# EasyEDA schematic SCH_FPGA-board_2025-07-17.json

## Sheets
1 Sheet_1: TITLE: Sheet_1; REV: 1.0; Date: 2025-06-11; Sheet: 1/1; Company: Your Company
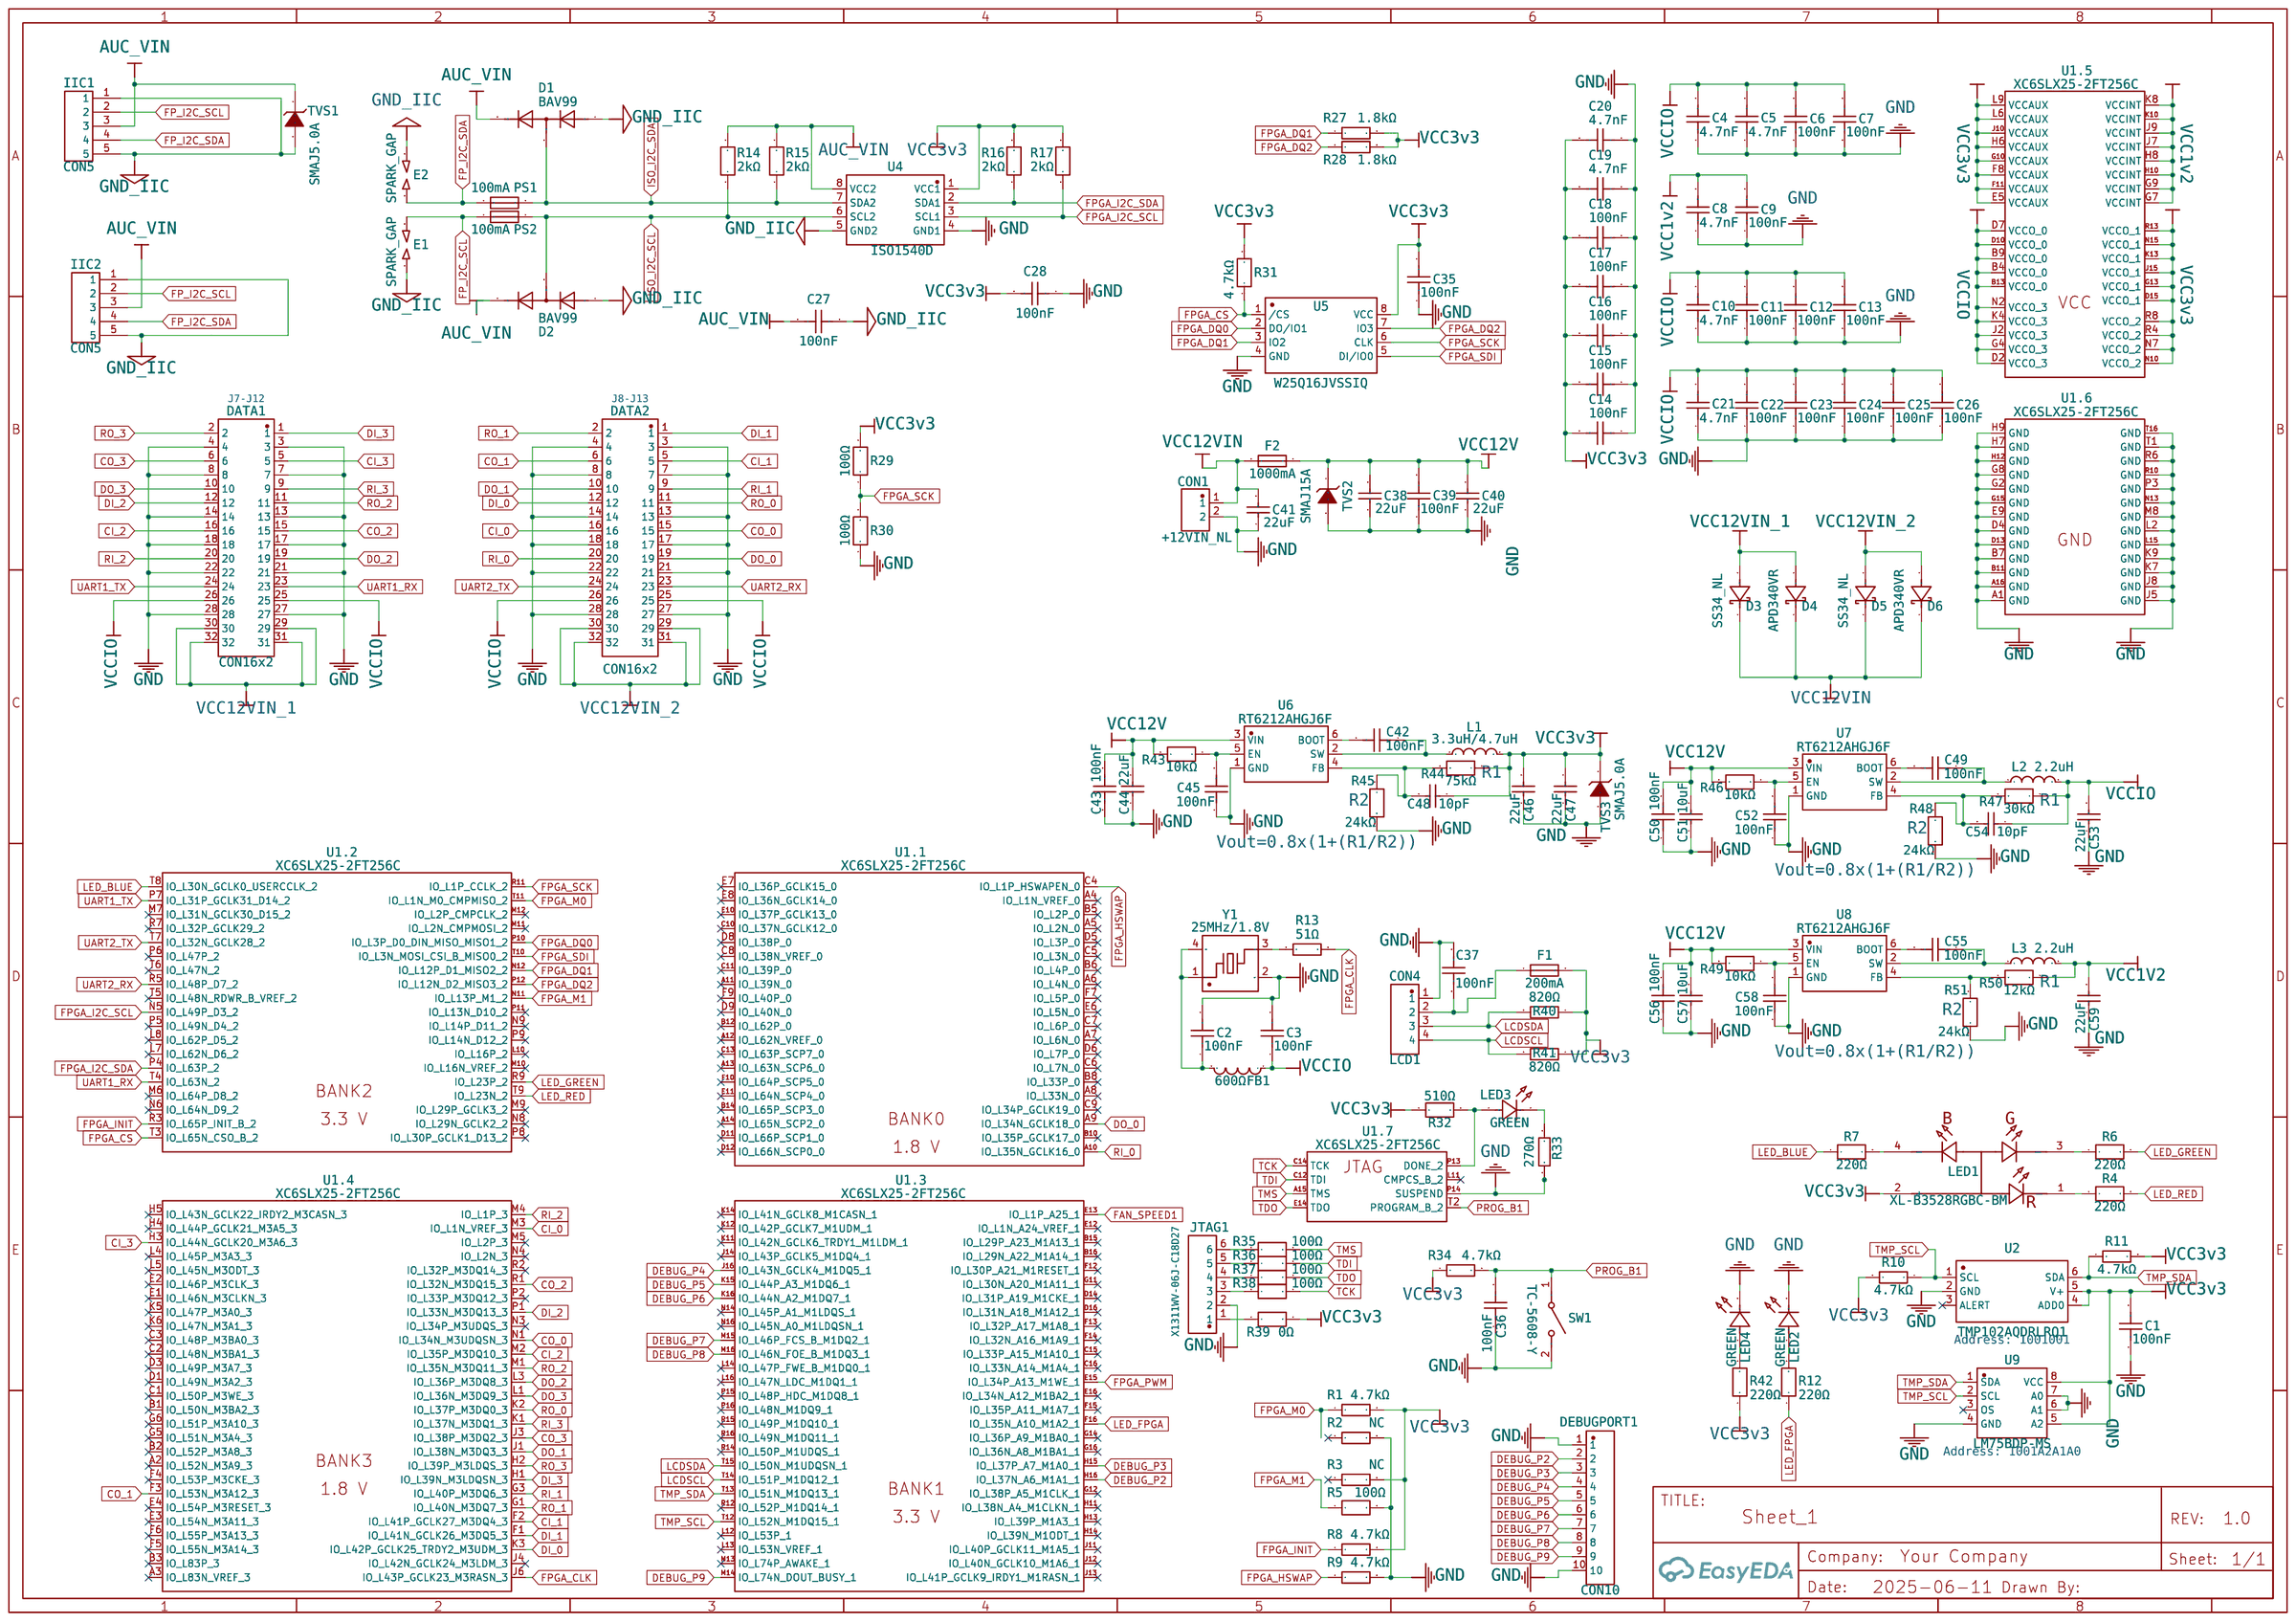
[diagram p0: Sheet_1]
2 Sheet_2: TITLE: Extend board; Date: 2025-07-18
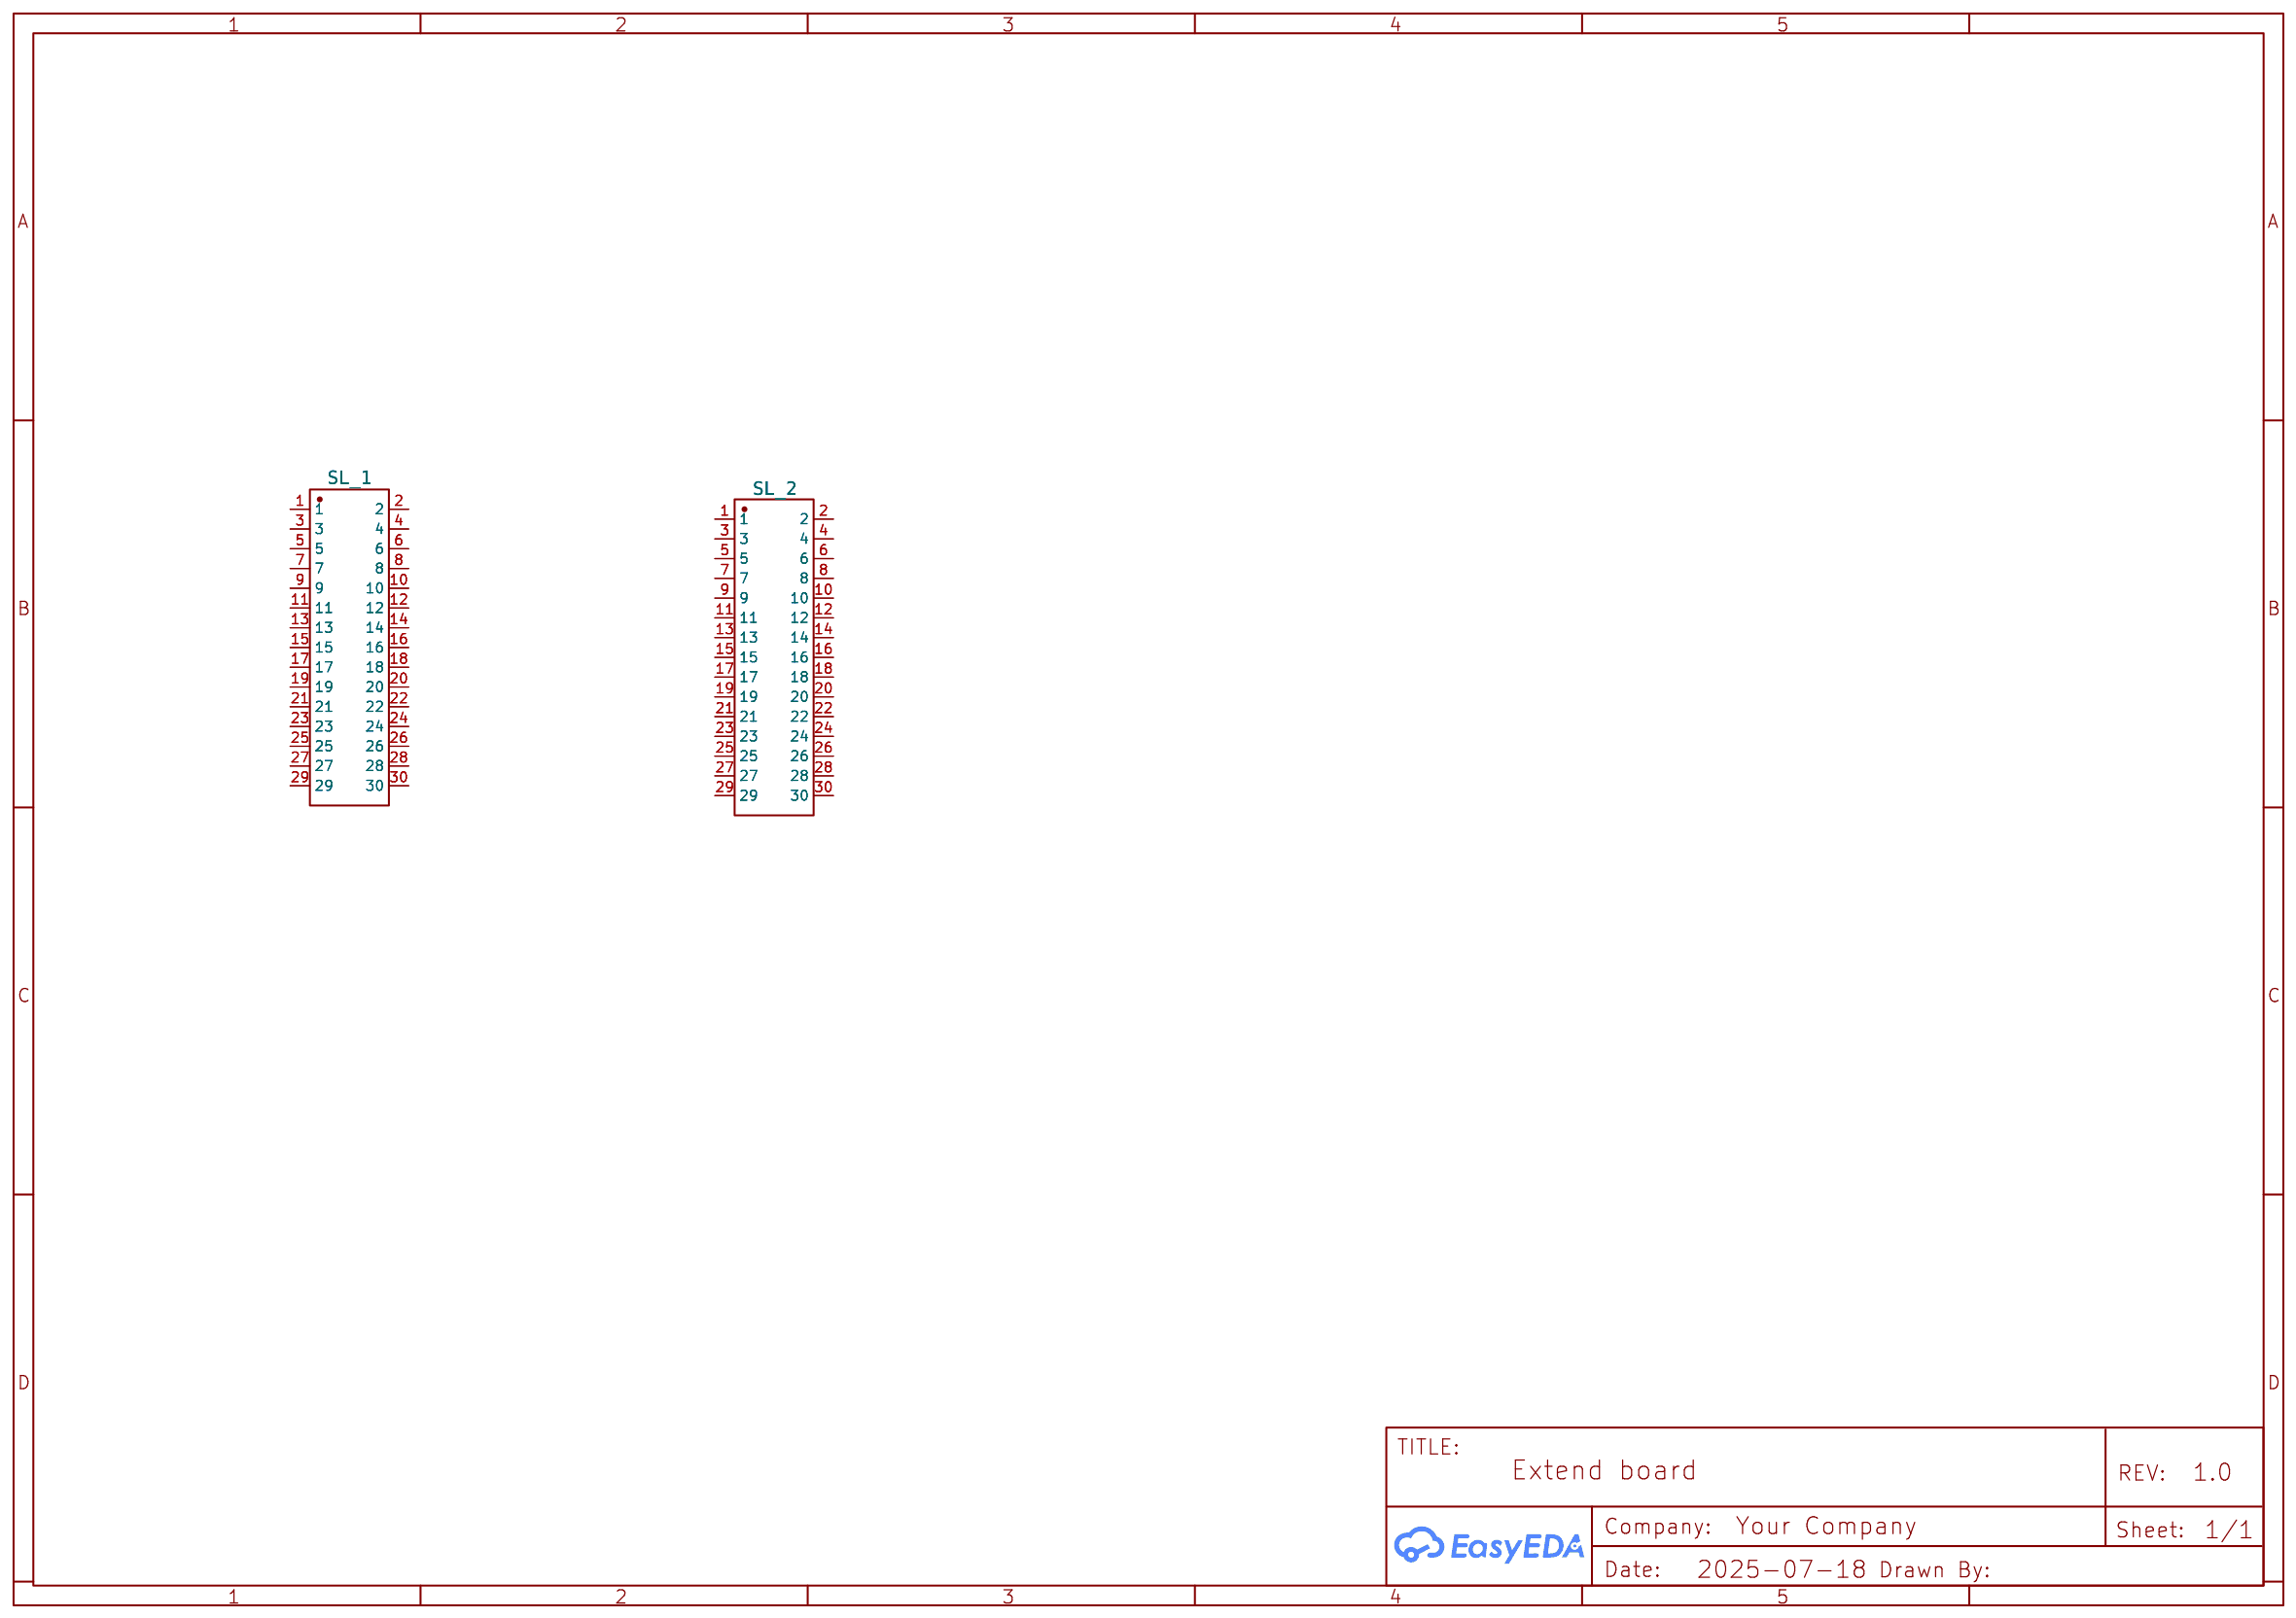
[diagram p1: Sheet_2]

## Parts
sheet Sheet_1
C1  100nF  [C0402]
C2  100nF  [C0402]
C3  100nF  [C0402]
C4  4.7nF  [C0402]
C5  4.7nF  [C0402]
C6  100nF  [C0402]
C7  100nF  [C0402]
C8  4.7nF  [C0402]
C9  100nF  [C0402]
C10  4.7nF  [C0402]
C11  100nF  [C0402]
C12  100nF  [C0402]
C13  100nF  [C0402]
C14  100nF  [C0402]
C15  100nF  [C0402]
C16  100nF  [C0402]
C17  100nF  [C0402]
C18  100nF  [C0402]
C19  4.7nF  [C0402]
C20  4.7nF  [C0402]
C21  4.7nF  [C0402]
C22  100nF  [C0402]
C23  100nF  [C0402]
C24  100nF  [C0402]
C25  100nF  [C0402]
C26  100nF  [C0402]
C27  100nF  [C0402]
C28  100nF  [C0402]
C35  100nF  [C0402]
C36  100nF  [C0402]
C37  100nF  [C0402]
C38  22uF  [C0805]
C39  100nF  [C0402]
C40  22uF  [C0805]
C41  22uF  [C0805]
C42  100nF  [C0402]
C43  100nF  [C0402]
C44  22uF  [C0805]
C45  100nF  [C0402]
C46  22uF  [C0805]
C47  22uF  [C0805]
C48  10pF  [C0805]
C49  100nF  [C0402]
C50  100nF  [C0402]
C51  10uF  [C0805]
C52  100nF  [C0402]
C53  22uF  [C0805]
C54  10pF  [C0805]
C55  100nF  [C0402]
C56  100nF  [C0402]
C57  10uF  [C0805]
C58  100nF  [C0402]
C59  22uF  [C0805]
CON1  +12VIN_NL  [CONN-TH_2.54-2P-WZDK-R-PITCH-CONNECTOR]
D1  BAV99  [SC-70-3_L2.1-W1.3-P1.30-LS2.1-BR]
D2  BAV99  [SC-70-3_L2.1-W1.3-P1.30-LS2.1-BR]
D3  SS34_NL  [SMA_L4.2-W2.7-LS5.0-RD]
D4  SS34_NL  [DO-214BA_L4.5-W2.6-LS5.4-RD]
D5  APD340VR  [SMA_L4.2-W2.7-LS5.0-RD]
D6  APD340VR  [DO-214BA_L4.5-W2.6-LS5.4-RD]
DATA1  CON16x2  [HDR-SMD_32P-P2.54-V-M-R2-C16-S7.4]
DATA2  CON16x2  [HDR-SMD_32P-P2.54-V-M-R2-C16-S7.4]
DEBUGPORT1  CON10  [HDR-TH_10P-P2.54-V-M]
E1  SPARK_GAP  [SPARK-GAP-8]
E2  SPARK_GAP  [SPARK-GAP-8]
F1  200mA  [F0805]
F2  1000mA  [F0805]
FB1  600Ω  [L0402]
IIC1  CON5  [XHB-TH_5PIN-V-PITCH2.50-R]
IIC2  CON5  [XHB-TH_5PIN-V-PITCH2.50-R]
JTAG1  X1311WV-06J-C18D27  [HDR-TH_6P-P1.27-V-M-1]
L1  3.3uH/4.7uH  [IND-SMD_L2.0-W1.6]
L2  2.2uH  [IND-SMD_L2.0-W1.6]
L3  2.2uH  [IND-SMD_L2.0-W1.6]
LCD1  CON4  [HDR-TH_4P-P1.27-V-M]
LED1  XL-B3528RGBC-BM  [LED-ARRAY-SMD_4P-L3.2-W2.8-BR_XL-B3528RGBC-BM]
LED2  GREEN  [LED0603-FD]
LED3  GREEN  [LED0603-FD]
LED4  GREEN  [LED0603-FD]
PS1  100mA  [F0603]
PS2  100mA  [F0603]
R1  4.7kΩ  [R0805]
R2  NC  [R0805]
R3  NC  [R0805]
R4  220Ω  [R0402]
R5  100Ω  [R0402]
R6  220Ω  [R0402]
R7  220Ω  [R0402]
R8  4.7kΩ  [R0805]
R9  4.7kΩ  [R0805]
R10  4.7kΩ  [R0805]
R11  4.7kΩ  [R0805]
R12  220Ω  [R0402]
R13  51Ω  [R0603]
R14  2kΩ  [R0402]
R15  2kΩ  [R0402]
R16  2kΩ  [R0402]
R17  2kΩ  [R0402]
R27  1.8kΩ  [R0402]
R28  1.8kΩ  [R0402]
R29  100Ω  [R0402]
R30  100Ω  [R0402]
R31  4.7kΩ  [R0402]
R32  510Ω  [R0603]
R33  270Ω  [R0603]
R34  4.7kΩ  [R0805]
R35  100Ω  [R0402]
R36  100Ω  [R0402]
R37  100Ω  [R0402]
R38  100Ω  [R0402]
R39  0Ω  [R0402]
R40  820Ω  [R0402]
R41  820Ω  [R0402]
R42  220Ω  [R0402]
R43  10kΩ  [R0402]
R44  75kΩ  [R0402]
R45  24kΩ  [R0402]
R46  10kΩ  [R0402]
R47  30kΩ  [R0402]
R48  24kΩ  [R0402]
R49  10kΩ  [R0402]
R50  12kΩ  [R0402]
R51  24kΩ  [R0402]
SW1  TC-5608-Y  [KEY-SMD_TC-5608-Y]
TVS1  SMAJ5.0A  [SMA_L4.3-W2.6-LS5.1-RD]
TVS2  SMAJ15A  [SMA_L4.3-W2.6-LS5.1-RD]
TVS3  SMAJ5.0A  [SMA_L4.3-W2.6-LS5.1-RD]
U1  XC6SLX25-2FT256C  [XC6SLX25-3FTG256]  (sections 1,2,3,4,5,6,7)
U2  TMP102AQDRLRQ1  [SOT-666-6_L1.6-W1.2-P0.50-LS1.6-BR]
U4  ISO1540D  [SOIC-8_L5.0-W4.0-P1.27-LS6.0-BL]
U5  W25Q16JVSSIQ  [SOIC-8_L5.3-W5.3-P1.27-LS8.0-BL]
U6  RT6212AHGJ6F  [SOT-23-6_L2.9-W1.6-P0.95-LS2.8-BL]
U7  RT6212AHGJ6F  [SOT-23-6_L2.9-W1.6-P0.95-LS2.8-BL]
U8  RT6212AHGJ6F  [SOT-23-6_L2.9-W1.6-P0.95-LS2.8-BL]
U9  LM75BDP-MS  [MSOP-8_L3.0-W3.0-P0.65-LS4.9-BL]
Y1  25MHz/1.8V  [CRYSTAL-SMD_4P-L3.2-W2.5-BL]
sheet Sheet_2
SL_1  HC-PM200-6.35H-2X15PZ  [HDR-TH_30P-P2.00-V-F-R2-C15-S2.00-1]
SL_2  HC-PM200-6.35H-2X15PZ  [HDR-TH_30P-P2.00-V-F-R2-C15-S2.00-1]

## Library data of the parts
C1-C3 C6 C7 C9 C11-C18 C22-C28 C35-C37 C39 C42 C43 C45 C49 C50 C52 C55 C56 C58 = FCC0402B104K160AT: Supplier: LCSC; Supplier Part: C5137468; Manufacturer: FOJAN(富捷); JLCPCB Part Class: Extended Part; Contributor: lcsc
C4 C5 C8 C10 C19-C21 = GRM155R71C472KA01D: Contributor: LCSC; Supplier: LCSC; Supplier Part: C441740; Manufacturer: muRata(村田); JLCPCB Part Class: Extended Part
C38 C40 C41 C44 C46-C48 C51 C53 C54 C57 C59 = CC0805MKX5R8BB226: Supplier: LCSC; Supplier Part: C784585; Manufacturer: YAGEO(国巨); JLCPCB Part Class: Extended Part; Contributor: lcsc
CON1 = 2.54-2P WZDK-R PITCH CONNECTOR: Supplier: LCSC; Supplier Part: C49023803; Manufacturer: SHOU HAN(首韩); Manufacturer Part: 2.54-2P WZDK-R Pitch Connector; JLCPCB Part Class: Extended Part; Contributor: lcsc
D1 D2 = BAV99WT1G: Contributor: LCSC; Supplier Part: C82078; Supplier: LCSC; Manufacturer: onsemi(安森美); JLCPCB Part Class: Extended Part
D3 D5 = SS34_C2909963: Contributor: LCSC; Supplier: LCSC; Supplier Part: C2909963; Manufacturer: YONGYUTAI(永裕泰); Manufacturer Part: SS34; JLCPCB Part Class: Extended Part
D4 D6 = SS34A_C2759883: Contributor: LCSC; Supplier: LCSC; Supplier Part: C2759883; Manufacturer: Leiditech(雷卯电子); Manufacturer Part: SS34A; JLCPCB Part Class: Extended Part
DATA1 DATA2 = KH-2.54PH-2X16P-L11.0-SMT: Supplier: LCSC; Supplier Part: C19630982; Manufacturer: kinghelm(金航标); Contributor: lcsc; JLCPCB Part Class: Extended Part
DEBUGPORT1 = DZ254R-11-10-63: Contributor: LCSC; Supplier: LCSC; Supplier Part: C2935916; Manufacturer: DEALON(德艺隆); JLCPCB Part Class: Extended Part
E1 E2 = SPARK_GAP: Contributor: surajk13; license: https://www.gnu.org/licenses/lgpl-2.1.html; Manufacturer Part: spark gap_0.3mm; link: https://eu.mouser.com/ProductDetail/Yageo/SQP500JB-330R?qs=sGAEpiMZZMukHu%252BjC5l7YQp%252BqQWMCRPe6cPdIgn3vDw%3D
F1 F2 = F0805B0R25FSTR: Supplier: LCSC; Supplier Part: C6245394; Manufacturer: Kyocera AVX; JLCPCB Part Class: Extended Part; Contributor: lcsc
FB1 = PBY100505T-601Y-N: Contributor: LCSC; Supplier: LCSC; Manufacturer: chilisin(奇力新); Supplier Part: C142082; JLCPCB Part Class: Extended Part
IIC1 IIC2 = XHB-5A: Supplier: LCSC; Manufacturer: BOOMELE(博穆精密); Supplier Part: C66559; JLCPCB Part Class: Extended Part
JTAG1 = X1311WV-06J-C18D27: Contributor: LCSC; Supplier: LCSC; Supplier Part: C2881651; Manufacturer: XKB Connection(中国星坤); JLCPCB Part Class: Extended Part
L1-L3 = SFE201610-4R7M: Contributor: lcsc; Supplier: LCSC; Supplier Part: C5159660; Manufacturer: DDY(德立); JLCPCB Part Class: Extended Part
LCD1 = DZ127R-11-04-25: Contributor: LCSC; Supplier: LCSC; Supplier Part: C2935944; Manufacturer: DEALON(德艺隆); JLCPCB Part Class: Extended Part
LED1 = XL-B3528RGBC-BM: Supplier: LCSC; Supplier Part: C5440719; Manufacturer: XINGLIGHT(成兴光); JLCPCB Part Class: Extended Part; Contributor: lcsc
LED2-LED4 = SM0603UPGC: Supplier: LCSC; Supplier Part: C6679544; Manufacturer: BIVAR; Contributor: lcsc; JLCPCB Part Class: Extended Part
PS1 PS2 = PTS060315V010: Supplier: LCSC; Supplier Part: C3762027; Manufacturer: EATON(伊顿); JLCPCB Part Class: Extended Part; Contributor: lcsc
R1-R3 R8-R11 R34 = CR0805F4K7P05: Contributor: LCSC; Supplier: LCSC; Supplier Part: C245341; Manufacturer: EVER OHMS(天二科技); Manufacturer Part: CR0805F4K70P05Z; JLCPCB Part Class: Extended Part
R4 R6 R7 R12 R42 = CRCW0402220RFKED: Contributor: LCSC; Supplier: LCSC; Supplier Part: C482103; Manufacturer: VISHAY(威世); JLCPCB Part Class: Extended Part
R5 = CRCW0402100RFKEDHP: Supplier: LCSC; Supplier Part: C844502; Manufacturer: VISHAY(威世); JLCPCB Part Class: Extended Part; Contributor: lcsc
R13 = CR0603FA51R0G: Supplier: LCSC; Manufacturer: LIZ(丽智电子); Supplier Part: C101090; JLCPCB Part Class: Extended Part
R14-R17 = ERA2AED202X: Contributor: LCSC; Supplier: LCSC; Supplier Part: C336808; Manufacturer: PANASONIC(松下); JLCPCB Part Class: Extended Part
R27 R28 = RC0402FR-071K8L: Contributor: LCSC; Supplier: LCSC; Manufacturer: YAGEO(国巨); Supplier Part: C163481; JLCPCB Part Class: Extended Part
R29 R30 R43-R51 = SR0402FR-7T100RL: Supplier: LCSC; Supplier Part: C854479; Manufacturer: YAGEO(国巨); JLCPCB Part Class: Extended Part; Contributor: lcsc
R31 = SY0402FN4K7P: Contributor: LCSC; Supplier: LCSC; Supplier Part: C380739; Manufacturer: SANYEAR(叁叶源); JLCPCB Part Class: Extended Part
R32 = AT0603BRD07510RL: Supplier: LCSC; Supplier Part: C5454463; Manufacturer: YAGEO(国巨); Contributor: lcsc
R33 = HPCR0603F270RK9: Contributor: LCSC; Supplier: LCSC; Supplier Part: C365130; Manufacturer: RESI(开步睿思); JLCPCB Part Class: Extended Part
R35-R38 = RC0402FR-07100RP: Supplier: LCSC; Supplier Part: C851815; Manufacturer: YAGEO(国巨); JLCPCB Part Class: Extended Part; Contributor: lcsc
R39 = SCR0402J0R: Contributor: lcsc; Supplier: LCSC; Supplier Part: C3017451; Manufacturer: VO(翔胜); JLCPCB Part Class: Extended Part
R40 R41 = AC0402FR-07820RL: Contributor: LCSC; Supplier: LCSC; Supplier Part: C227240; Manufacturer: YAGEO(国巨); JLCPCB Part Class: Extended Part
SW1 = TC-5608-Y: Contributor: lcsc; Supplier: LCSC; Supplier Part: C5148427; Manufacturer: Yuandi(元迪); JLCPCB Part Class: Extended Part
TVS1-TVS3 = SMAJ5.0A-AT: Contributor: LCSC; Supplier: LCSC; Supplier Part: C523242; Manufacturer: Brightking(君耀电子); Manufacturer Part: SMAJ5.0A-AT/TR13; JLCPCB Part Class: Extended Part
U1 = XC6SLX25-2FT256C: Manufacturer: AMD(超微); Supplier: LCSC; Supplier Part: C7416133; Contributor: 1234ujif; subpart_no: 1
U2 = TMP102AQDRLRQ1: Contributor: LCSC; Supplier: LCSC; Manufacturer: TI(德州仪器); Supplier Part: C130042; JLCPCB Part Class: Extended Part
U4 = ISO1540D: Contributor: LCSC; Supplier: LCSC; Supplier Part: C2878172; Manufacturer: TI(德州仪器); JLCPCB Part Class: Extended Part
U5 = W25Q16JVSSIQ: Supplier: LCSC; Manufacturer: WINBOND(华邦); Supplier Part: C82317; JLCPCB Part Class: Extended Part
U6-U8 = RT6212AHGJ6F: Contributor: LCSC; Supplier: LCSC; Supplier Part: C250402; Manufacturer: RICHTEK(立锜); JLCPCB Part Class: Extended Part; Package Display: No
U9 = LM75BDP-MS: Supplier: LCSC; Supplier Part: C18547812; Manufacturer: MSKSEMI(美森科); Contributor: lcsc; JLCPCB Part Class: Extended Part
Y1 = FL2500047: Supplier: LCSC; Supplier Part: C5701090; Manufacturer: DIODES(美台); JLCPCB Part Class: Extended Part; Contributor: lcsc
SL_1 SL_2 = HC-PM200-6.35H-2X15PZ: Supplier: LCSC; Supplier Part: C41376153; Manufacturer: HC(虹成电子); Manufacturer Part: HC-PM200-6.35H-2x15PZ; Contributor: lcsc

## Nets
GND: C1.1 C2.2 C3.2 C4.1 C5.1 C6.1 C7.1 C8.1 C9.1 C10.1 C11.1 C12.1 C13.1 C14.1 C15.1 C16.1 C17.1 C18.1 C19.1 C20.1 C21.1 C22.1 C23.1 C24.1 C25.1 C26.1 C28.1 C35.1 C36.1 C37.2 C38.1 C39.1 C40.1 C41.1 C43.1 C44.1 C45.1 C46.1 C47.1 C50.1 C51.1 C52.1 C53.1 C56.1 C57.1 C58.1 C59.1 CON1.2 DATA1.3 DATA1.4 DATA1.7 DATA1.8 DATA1.13 DATA1.14 DATA1.17 DATA1.18 DATA1.21 DATA1.22 DATA1.27 DATA1.28 DATA2.3 DATA2.4 DATA2.7 DATA2.8 DATA2.13 DATA2.14 DATA2.17 DATA2.18 DATA2.21 DATA2.22 DATA2.27 DATA2.28 DEBUGPORT1.1 DEBUGPORT1.10 JTAG1.2 LCD1.1 LED2.2(K) LED4.2(K) R2.2 R5.2 R9.2 R30.1 R33.1 R45.2 R48.2 R51.2 SW1.2 TVS2.2(A) TVS3.2(A) U1.A1(GND) U1.A16(GND) U1.B7(GND) U1.B11(GND) U1.D4(GND) U1.D13(GND) U1.E9(GND) U1.G2(GND) U1.G8(GND) U1.G15(GND) U1.H7(GND) U1.H9(GND) U1.H12(GND) U1.J5(GND) U1.J8(GND) U1.K7(GND) U1.K9(GND) U1.L2(GND) U1.L15(GND) U1.M8(GND) U1.N13(GND) U1.P3(GND) U1.P14(SUSPEND) U1.R6(GND) U1.R10(GND) U1.T1(GND) U1.T16(GND) U2.2(GND) U4.4(GND1) U5.4(GND) U6.1(GND) U7.1(GND) U8.1(GND) U9.4(GND) U9.6(A1) U9.7(A0) Y1.2(GND)
GND_IIC: C27.1 D1.1(A) D2.1(A) E1.1 E2.2 IIC1.1 IIC1.5 IIC2.1 IIC2.5 TVS1.2(A) U4.5(GND2)
VCC1v2: C8.2 C9.2 U1.G7(VCCINT) U1.G9(VCCINT) U1.H8(VCCINT) U1.H10(VCCINT) U1.J7(VCCINT) U1.J9(VCCINT) U1.K8(VCCINT) U1.K10(VCCINT)
VCC1V2: C59.2 L3.2 R50.1
VCC3v3: C1.2 C14.2 C15.2 C16.2 C17.2 C18.2 C19.2 C20.2 C28.2 C35.2 C46.2 C47.2 C48.1 F1.2 L1.2 LED1.2(+) R1.2 R3.2 R8.2 R10.2 R11.2 R16.2 R17.2 R27.2 R28.2 R29.2 R31.2 R32.1 R34.1 R39.2 R40.1 R41.1 R42.1 R44.1 TVS3.1(C) U1.D15(VCCO_1) U1.E5(VCCAUX) U1.F8(VCCAUX) U1.F11(VCCAUX) U1.G10(VCCAUX) U1.G13(VCCO_1) U1.H6(VCCAUX) U1.J10(VCCAUX) U1.J15(VCCO_1) U1.K13(VCCO_1) U1.L6(VCCAUX) U1.L9(VCCAUX) U1.N7(VCCO_2) U1.N10(VCCO_2) U1.N15(VCCO_1) U1.R4(VCCO_2) U1.R8(VCCO_2) U1.R13(VCCO_1) U2.4(ADD0) U2.5(V+) U4.1(VCC1) U5.8(VCC) U9.5(A2) U9.8(VCC)
VCC12V: C38.2 C39.2 C40.2 C43.2 C44.2 C50.2 C51.2 C56.2 C57.2 F2.2 R43.2 R46.2 R49.2 TVS2.1(C) U6.3(VIN) U7.3(VIN) U8.3(VIN)
VCC12VIN: C41.2 CON1.1 D3.1 D4.1(K) D5.1 D6.1(K) F2.1
VCC12VIN_1: D3.2 D4.2(A) DATA1.29 DATA1.30 DATA1.31 DATA1.32
VCC12VIN_2: D5.2 D6.2(A) DATA2.29 DATA2.30 DATA2.31 DATA2.32
VCCIO: C3.1 C4.2 C5.2 C6.2 C7.2 C10.2 C11.2 C12.2 C13.2 C21.2 C22.2 C23.2 C24.2 C25.2 C26.2 C53.2 C54.1 DATA1.25 DATA1.26 DATA2.25 DATA2.26 FB1.1 L2.2 R47.1 U1.B4(VCCO_0) U1.B9(VCCO_0) U1.B13(VCCO_0) U1.D2(VCCO_3) U1.D7(VCCO_0) U1.D10(VCCO_0) U1.G4(VCCO_3) U1.J2(VCCO_3) U1.K4(VCCO_3) U1.N2(VCCO_3)
AUC_VIN: C27.2 D1.2(C) D2.2(C) IIC1.3 IIC2.3 R14.2 R15.2 TVS1.1(C) U4.8(VCC2)
CI_0: DATA2.16 U1.M3(IO_L1N_VREF_3)
CI_1: DATA2.5 U1.F2(IO_L41P_GCLK27_M3DQ4_3)
CI_2: DATA1.16 U1.M2(IO_L35P_M3DQ10_3)
CI_3: DATA1.5 U1.H3(IO_L44N_GCLK20_M3A6_3)
CO_0: DATA2.15 U1.N1(IO_L34N_M3UDQSN_3)
CO_1: DATA2.6 U1.F3(IO_L53N_M3A12_3)
CO_2: DATA1.15 U1.R1(IO_L32N_M3DQ15_3)
CO_3: DATA1.6 U1.J3(IO_L38P_M3DQ2_3)
DEBUG_P2: DEBUGPORT1.2 U1.H16(IO_L37N_A6_M1A1_1)
DEBUG_P3: DEBUGPORT1.3 U1.H15(IO_L37P_A7_M1A0_1)
DEBUG_P4: DEBUGPORT1.4 U1.J16(IO_L43N_GCLK4_M1DQ5_1)
DEBUG_P5: DEBUGPORT1.5 U1.K15(IO_L44P_A3_M1DQ6_1)
DEBUG_P6: DEBUGPORT1.6 U1.K16(IO_L44N_A2_M1DQ7_1)
DEBUG_P7: DEBUGPORT1.7 U1.M15(IO_L46P_FCS_B_M1DQ2_1)
DEBUG_P8: DEBUGPORT1.8 U1.M16(IO_L46N_FOE_B_M1DQ3_1)
DEBUG_P9: DEBUGPORT1.9 U1.M14(IO_L74N_DOUT_BUSY_1)
DI_0: DATA2.12 U1.K3(IO_L42P_GCLK25_TRDY2_M3UDM_3)
DI_1: DATA2.1 U1.F1(IO_L41N_GCLK26_M3DQ5_3)
DI_2: DATA1.12 U1.P1(IO_L33N_M3DQ13_3)
DI_3: DATA1.1 U1.H1(IO_L39N_M3LDQSN_3)
DO_0: DATA2.19 U1.A9(IO_L34N_GCLK18_0)
DO_1: DATA2.10 U1.J1(IO_L38N_M3DQ3_3)
DO_2: DATA1.19 U1.L3(IO_L36P_M3DQ8_3)
DO_3: DATA1.10 U1.L1(IO_L36N_M3DQ9_3)
FAN_SPEED1: U1.E13(IO_L1P_A25_1)
FP_I2C_SCL: E1.2 IIC1.2 IIC2.2 PS2.1
FP_I2C_SDA: E2.1 IIC1.4 IIC2.4 PS1.1
FPGA_CLK: R13.2 U1.J6(IO_L43P_GCLK23_M3RASN_3)
FPGA_CS: R31.1 U1.T3(IO_L65N_CSO_B_2) U5.1(/CS)
FPGA_DQ0: U1.P10(IO_L3P_D0_DIN_MISO_MISO1_2) U5.2(DO/IO1)
FPGA_DQ1: R27.1 U1.N12(IO_L12P_D1_MISO2_2) U5.3(IO2)
FPGA_DQ2: R28.1 U1.P12(IO_L12N_D2_MISO3_2) U5.7(IO3)
FPGA_HSWAP: R9.1 U1.C4(IO_L1P_HSWAPEN_0)
FPGA_I2C_SCL: R17.1 U1.N5(IO_L49P_D3_2) U4.3(SCL1)
FPGA_I2C_SDA: R16.1 U1.P4(IO_L63P_2) U4.2(SDA1)
FPGA_INIT: R8.1 U1.R3(IO_L65P_INIT_B_2)
FPGA_M0: R1.1 U1.T11(IO_L1N_M0_CMPMISO_2)
FPGA_M1: R5.1 U1.N11(IO_L13P_M1_2)
FPGA_PWM: U1.E15(IO_L34P_A13_M1WE_1)
FPGA_SCK: R29.1 R30.2 U1.R11(IO_L1P_CCLK_2) U5.6(CLK)
FPGA_SDI: U1.T10(IO_L3N_MOSI_CSI_B_MISO0_2) U5.5(DI/IO0)
ISO_I2C_SCL: D2.3(A/C) PS2.2 R14.1 U4.6(SCL2)
ISO_I2C_SDA: D1.3(A/C) PS1.2 R15.1 U4.7(SDA2)
LCDSCL: LCD1.4 R41.2 U1.T14(IO_L51P_M1DQ12_1)
LCDSDA: LCD1.3 R40.2 U1.T15(IO_L50N_M1UDQSN_1)
LED_BLUE: R7.1 U1.T8(IO_L30N_GCLK0_USERCCLK_2)
LED_FPGA: R12.1 U1.F16(IO_L35N_A10_M1A2_1)
LED_GREEN: R6.2 U1.R9(IO_L23P_2)
LED_RED: R4.2 U1.T9(IO_L23N_2)
PROG_B1: C36.2 R34.2 SW1.1 U1.T2(PROGRAM_B_2)
RI_0: DATA2.20 U1.A10(IO_L35N_GCLK16_0)
RI_1: DATA2.9 U1.G3(IO_L40P_M3DQ6_3)
RI_2: DATA1.20 U1.M4(IO_L1P_3)
RI_3: DATA1.9 U1.K1(IO_L37N_M3DQ1_3)
RO_0: DATA2.11 U1.K2(IO_L37P_M3DQ0_3)
RO_1: DATA2.2 U1.G1(IO_L40N_M3DQ7_3)
RO_2: DATA1.11 U1.M1(IO_L35N_M3DQ11_3)
RO_3: DATA1.2 U1.H2(IO_L39P_M3LDQS_3)
TCK: R38.2 U1.C14(TCK)
TDI: R36.2 U1.C12(TDI)
TDO: R37.2 U1.E14(TDO)
TMP_SCL: R10.1 U1.T12(IO_L52N_M1DQ15_1) U2.1(SCL) U9.2(SCL)
TMP_SDA: R11.1 U1.T13(IO_L51N_M1DQ13_1) U2.6(SDA) U9.1(SDA)
TMS: R35.2 U1.A15(TMS)
UART1_RX: DATA1.23 U1.T4(IO_L63N_2)
UART1_TX: DATA1.24 U1.P7(IO_L31P_GCLK31_D14_2)
UART2_RX: DATA2.23 U1.R5(IO_L48P_D7_2)
UART2_TX: DATA2.24 U1.T7(IO_L32N_GCLK28_2)
Net-(C2-1): C2.1 FB1.2 Y1.1 Y1.4(GND)
Net-(C37-1): C37.1 F1.1 LCD1.2
Net-(C42-1): C42.1 L1.1 U6.2(SW)
Net-(C42-2): C42.2 U6.6(BOOT)
Net-(C45-2): C45.2 R43.1 U6.5(EN)
Net-(C48-2): C48.2 R44.2 R45.1 U6.4(FB)
Net-(C49-1): C49.1 L2.1 U7.2(SW)
Net-(C49-2): C49.2 U7.6(BOOT)
Net-(C52-2): C52.2 R46.1 U7.5(EN)
Net-(C54-2): C54.2 R47.2 R48.1 U7.4(FB)
Net-(C55-1): C55.1 L3.1 U8.2(SW)
Net-(C55-2): C55.2 U8.6(BOOT)
Net-(C58-2): C58.2 R49.1 U8.5(EN)
Net-(JTAG1-1): JTAG1.1 R39.1
Net-(JTAG1-3): JTAG1.3 R38.1
Net-(JTAG1-4): JTAG1.4 R37.1
Net-(JTAG1-5): JTAG1.5 R36.1
Net-(JTAG1-6): JTAG1.6 R35.1
Net-(LED1-1): LED1.1(-) R4.1
Net-(LED1-3): LED1.3(-) R6.1
Net-(LED1-4): LED1.4(-) R7.2
Net-(LED2-1): LED2.1(A) R12.2
Net-(LED3-1): LED3.1(A) R32.2 U1.P13(DONE_2)
Net-(LED3-2): LED3.2(K) R33.2
Net-(LED4-1): LED4.1(A) R42.2
Net-(R13-1): R13.1 Y1.3
Net-(R50-2): R50.2 R51.1 U8.4(FB)

Not connected (* = marked no-connect by the designer): R2 1*; R3 1*; SL_1 1 2 3 4 5 6 7 8 9 10 11 12 13 14 15 16 17 18 19 20 21 22 23 24 25 26 27 28 29 30; SL_2 1 2 3 4 5 6 7 8 9 10 11 12 13 14 15 16 17 18 19 20 21 22 23 24 25 26 27 28 29 30; U1 A2(IO_L52N_M3A9_3)* A3(IO_L83N_VREF_3)* A4(IO_L1N_VREF_0)* A5(IO_L2N_0)* A6(IO_L4N_0)* A7(IO_L6N_0)* A8(IO_L33N_0)* A11(IO_L39N_0)* A12(IO_L62N_VREF_0)* A13(IO_L63N_SCP6_0)* A14(IO_L65N_SCP2_0)* B1(IO_L50N_M3BA2_3)* B2(IO_L52P_M3A8_3)* B3(IO_L83P_3)* B5(IO_L2P_0)* B6(IO_L4P_0)* B8(IO_L33P_0)* B10(IO_L35P_GCLK17_0)* B12(IO_L62P_0)* B14(IO_L65P_SCP3_0)* B15(IO_L29P_A23_M1A13_1)* B16(IO_L29N_A22_M1A14_1)* C1(IO_L50P_M3WE_3)* C2(IO_L48N_M3BA1_3)* C3(IO_L48P_M3BA0_3)* C5(IO_L3N_0)* C6(IO_L7N_0)* C7(IO_L6P_0)* C8(IO_L38N_VREF_0)* C9(IO_L34P_GCLK19_0)* C10(IO_L37N_GCLK12_0)* C11(IO_L39P_0)* C13(IO_L63P_SCP7_0)* C15(IO_L33P_A15_M1A10_1)* C16(IO_L33N_A14_M1A4_1)* D1(IO_L49N_M3A2_3)* D3(IO_L49P_M3A7_3)* D5(IO_L3P_0)* D6(IO_L7P_0)* D8(IO_L38P_0)* D9(IO_L40N_0)* D11(IO_L66P_SCP1_0)* D12(IO_L66N_SCP0_0)* D14(IO_L31P_A19_M1CKE_1)* D16(IO_L31N_A18_M1A12_1)* E1(IO_L46N_M3CLKN_3)* E2(IO_L46P_M3CLK_3)* E3(IO_L54N_M3A11_3)* E4(IO_L54P_M3RESET_3)* E6(IO_L5N_0)* E7(IO_L36P_GCLK15_0)* E8(IO_L36N_GCLK14_0)* E10(IO_L37P_GCLK13_0)* E11(IO_L64N_SCP4_0)* E12(IO_L1N_A24_VREF_1)* E16(IO_L34N_A12_M1BA2_1)* F4(IO_L53P_M3CKE_3)* F5(IO_L55N_M3A14_3)* F6(IO_L55P_M3A13_3)* F7(IO_L5P_0)* F9(IO_L40P_0)* F10(IO_L64P_SCP5_0)* F12(IO_L30P_A21_M1RESET_1)* F13(IO_L32P_A17_M1A8_1)* F14(IO_L32N_A16_M1A9_1)* F15(IO_L35P_A11_M1A7_1)* G5(IO_L51N_M3A4_3)* G6(IO_L51P_M3A10_3)* G11(IO_L30N_A20_M1A11_1)* G12(IO_L38P_A5_M1CLK_1)* G14(IO_L36P_A9_M1BA0_1)* G16(IO_L36N_A8_M1BA1_1)* H4(IO_L44P_GCLK21_M3A5_3)* H5(IO_L43N_GCLK22_IRDY2_M3CASN_3)* H11(IO_L38N_A4_M1CLKN_1)* H13(IO_L39P_M1A3_1)* H14(IO_L39N_M1ODT_1)* J4(IO_L42N_GCLK24_M3LDM_3)* J11(IO_L40P_GCLK11_M1A5_1)* J12(IO_L40N_GCLK10_M1A6_1)* J13(IO_L41P_GCLK9_IRDY1_M1RASN_1)* J14(IO_L43P_GCLK5_M1DQ4_1)* K5(IO_L47P_M3A0_3)* K6(IO_L47N_M3A1_3)* K11(IO_L42N_GCLK6_TRDY1_M1LDM_1)* K12(IO_L42P_GCLK7_M1UDM_1)* K14(IO_L41N_GCLK8_M1CASN_1)* L4(IO_L45P_M3A3_3)* L5(IO_L45N_M3ODT_3)* L7(IO_L62N_D6_2)* L8(IO_L62P_D5_2)* L10(IO_L16P_2)* L11(CMPCS_B_2)* L12(IO_L53P_1)* L13(IO_L53N_VREF_1)* L14(IO_L47P_FWE_B_M1DQ0_1)* L16(IO_L47N_LDC_M1DQ1_1)* M5(IO_L2P_3)* M6(IO_L64P_D8_2)* M7(IO_L31N_GCLK30_D15_2)* M9(IO_L29P_GCLK3_2)* M10(IO_L16N_VREF_2)* M11(IO_L2N_CMPMOSI_2)* M12(IO_L2P_CMPCLK_2)* M13(IO_L74P_AWAKE_1)* N3(IO_L34P_M3UDQS_3)* N4(IO_L2N_3)* N6(IO_L64N_D9_2)* N8(IO_L29N_GCLK2_2)* N9(IO_L14P_D11_2)* N14(IO_L45P_A1_M1LDQS_1)* N16(IO_L45N_A0_M1LDQSN_1)* P2(IO_L33P_M3DQ12_3)* P5(IO_L49N_D4_2)* P6(IO_L47P_2)* P8(IO_L30P_GCLK1_D13_2)* P9(IO_L14N_D12_2)* P11(IO_L13N_D10_2)* P15(IO_L48P_HDC_M1DQ8_1)* P16(IO_L48N_M1DQ9_1)* R2(IO_L32P_M3DQ14_3)* R7(IO_L32P_GCLK29_2)* R12(IO_L52P_M1DQ14_1)* R14(IO_L50P_M1UDQS_1)* R15(IO_L49P_M1DQ10_1)* R16(IO_L49N_M1DQ11_1)* T5(IO_L48N_RDWR_B_VREF_2)* T6(IO_L47N_2)*; U2 3(ALERT)*; U9 3(OS)*

## Notes on the sheets
sheet 1
- J7-J12
- J8-J13
- R1
- R2
- R1
- Vout=0.8x(1+(R1/R2))
- R2
- Vout=0.8x(1+(R1/R2))
- R1
- R2
- Vout=0.8x(1+(R1/R2))
- Address: 1001001
- Address: 1001A2A1A0
